# EAGLE design SB (EAGLE 7.7.0)
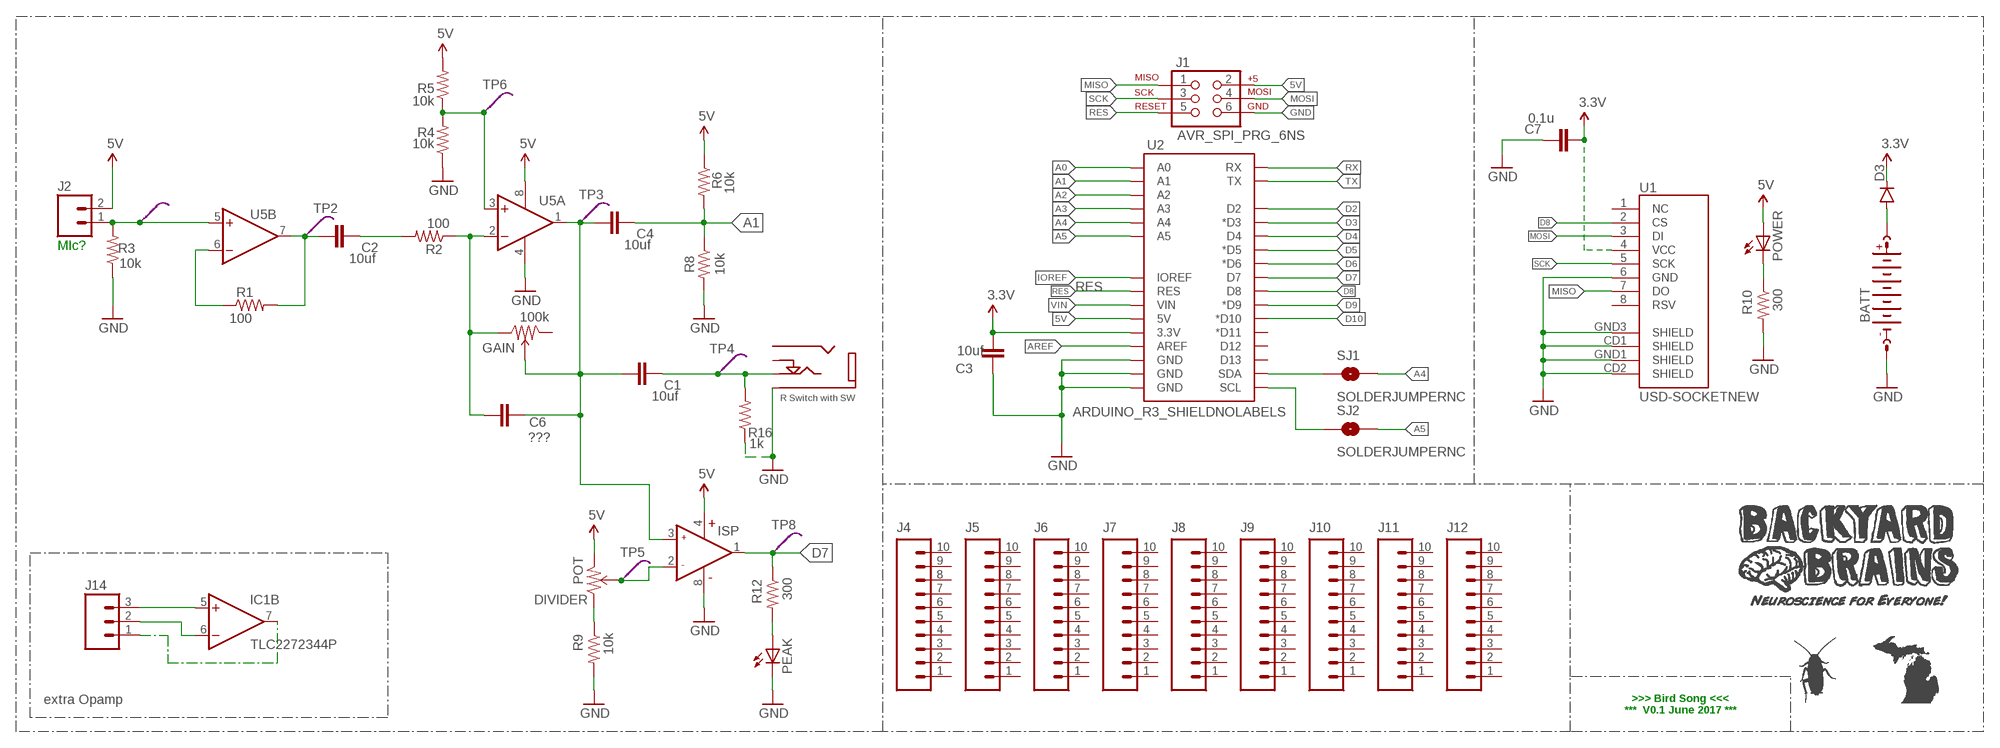
[diagram p0: schematic, sheet 1]

## Parts
BATT  BATTERY-16MMSMD  [16M_BATT_SMD]
C1  10uf  M2-CAP  [M2-CAP]
C2  10uf  M2-CAP  [M2-CAP]
C3  10uf  M2-CAP  [M2-CAP]
C4  10uf  M2-CAP  [M2-CAP]
C6  ???  M2-CAP  [M2-CAP]
C7  0.1u  M2-CAP  [M2-CAP]
D3  DIODE1N4148  [DIODE-1N4148]
DIVIDER  POT  [BURNS-SCREW-POT]
GAIN  100k  POT  [BURNS-SCREW-POT]
IC1  TLC2272344P  [DIL08]
J1  AVR_SPI_PRG_6NS  [2X3-NS]
J2  M02PTH  [1X02]
J3  AUDIOJACK  [3.5MM-SMALL-JACK-NEW]
J4  M10SILK_FEMALE_PTH  [1X10]
J5  M10SILK_FEMALE_PTH  [1X10]
J6  M10SILK_FEMALE_PTH  [1X10]
J7  M10SILK_FEMALE_PTH  [1X10]
J8  M10SILK_FEMALE_PTH  [1X10]
J9  M10SILK_FEMALE_PTH  [1X10]
J10  M10SILK_FEMALE_PTH  [1X10]
J11  M10SILK_FEMALE_PTH  [1X10]
J12  M10SILK_FEMALE_PTH  [1X10]
J14  M03PTH  [1X03]
PEAK  LED5MM  [LED5MM]
POWER  LED5MM  [LED5MM]
R1  100  M2-RES  [M2-RES]
R2  100  M2-RES  [M2-RES]
R3  10k  M2-RES  [M2-RES]
R4  10k  M2-RES  [M2-RES]
R5  10k  M2-RES  [M2-RES]
R6  10k  M2-RES  [M2-RES]
R8  10k  M2-RES  [M2-RES]
R9  10k  M2-RES  [M2-RES]
R10  300  M2-RES  [M2-RES]
R12  300  M2-RES  [M2-RES]
R16  1k  M2-RES  [M2-RES]
SJ1  SOLDERJUMPERNC  [SJ_2S]
SJ2  SOLDERJUMPERNC  [SJ_2S]
TP1  TEST  [PROBE_TP]
TP2  TEST  [PROBE_TP]
TP3  TEST  [PROBE_TP]
TP4  TEST  [PROBE_TP]
TP5  TEST  [PROBE_TP]
TP6  TEST  [PROBE_TP]
TP8  TEST  [PROBE_TP]
U1  USD-SOCKETNEW  [MICRO-SD-SOCKET-PP]
U2  ARDUINO_R3_SHIELDNOLABELS  [UNO_R3_SHIELD_NOLABELS]
U5  TLC2272344P  [DIL08]

## Nets
3.3V: C3.1 C7.1 D3.C U1.4(VCC) U2.3.3V
5V: DIVIDER.1 IC1.4(A:V-) J1.2 J2.2 POWER.A R5.2 R6.1 U2.5V U5.8(A:V+)
A0: U2.A0
A1: C4.2 R6.2 R8.1 U2.A1
A2: U2.A2
A3: U2.A3
A4: SJ1.2 U2.A4
A5: SJ2.2 U2.A5
AMP2: C2.1 R1.2 TP2.P$1(TP) U5.7(B:OUT)
AREF: U2.AREF
D2: U2.D2
D3: U2.D3(*D3)
D4: U2.D4
D5: U2.D5(*D5)
D6: U2.D6(*D6)
D7: IC1.1(A:OUT) R12.1 TP8.P$1(TP) U2.D7
D8: U1.2(CS) U2.D8
D9: U2.D9(*D9)
D10: U2.D10(*D10)
FILTER: C1.1 C4.1 C6.2 GAIN.2 IC1.3(A:IN+) TP3.P$1(TP) U5.1(A:OUT)
GND: BATT.NEG(-) C3.2 C7.2 IC1.8(A:V+) J1.6 J3.SHIELD PEAK.K(C) R3.1 R4.1 R8.2 R9.2 R10.2 R16.1 U1.6(GND) U1.CD1(SHIELD) U1.CD2(SHIELD) U1.GND1(SHIELD) U1.GND3(SHIELD) U2.GND@0(GND) U2.GND@1(GND) U2.GND@2(GND) U5.4(A:V-)
IOREF: U2.IOREF
MISO: J1.1 U1.7(DO)
MOSI: J1.4 U1.3(DI)
N$1: J2.1 R3.2 TP1.P$1(TP) U5.5(B:+IN)
N$2: BATT.POS1(+) BATT.POS2(+) D3.A
N$3: R1.1 U5.6(B:-IN)
N$4: C2.2 R2.2
N$5: R4.2 R5.1 TP6.P$1(TP) U5.3(A:+IN)
N$6: POWER.K(C) R10.1
N$7: DIVIDER.3 R9.1
N$8: IC1.5(B:+IN) J14.3
N$9: IC1.6(B:-IN) J14.2
N$10: IC1.7(B:OUT) J14.1
N$11: DIVIDER.2 IC1.2(A:IN-) TP5.P$1(TP)
N$14: PEAK.A R12.2
N$17: C1.2 J3.R R16.2 TP4.P$1(TP)
N$21: C6.1 GAIN.3 R2.1 U5.2(A:-IN)
RES: J1.5 U2.RES
RX: U2.RX
SCK: J1.3 U1.5(SCK)
SCL: SJ2.1 U2.SCL
SDA: SJ1.1 U2.SDA
TX: U2.TX
VIN: U2.VIN
Unconnected: GAIN.1 J3.L J3.SW(SWITCH) J4.1 J4.2 J4.3 J4.4 J4.5 J4.6 J4.7 J4.8 J4.9 J4.10 J5.1 J5.2 J5.3 J5.4 J5.5 J5.6 J5.7 J5.8 J5.9 J5.10 J6.1 J6.2 J6.3 J6.4 J6.5 J6.6 J6.7 J6.8 J6.9 J6.10 J7.1 J7.2 J7.3 J7.4 J7.5 J7.6 J7.7 J7.8 J7.9 J7.10 J8.1 J8.2 J8.3 J8.4 J8.5 J8.6 J8.7 J8.8 J8.9 J8.10 J9.1 J9.2 J9.3 J9.4 J9.5 J9.6 J9.7 J9.8 J9.9 J9.10 J10.1 J10.2 J10.3 J10.4 J10.5 J10.6 J10.7 J10.8 J10.9 J10.10 J11.1 J11.2 J11.3 J11.4 J11.5 J11.6 J11.7 J11.8 J11.9 J11.10 J12.1 J12.2 J12.3 J12.4 J12.5 J12.6 J12.7 J12.8 J12.9 J12.10 U1.1(NC) U1.8(RSV) U2.D11(*D11) U2.D12 U2.D13

## Notes on the sheet
- MIc?
- extra Opamp
- >>> Bird Song <<<
  ***  V0.1 June 2017 ***

## Library data of the parts
BATT = byb:BATTERY-16MM
C1-C4 C6 C7 = 1MaxBYB:M2-CAP; DIGIKEY: BC1150CT-ND; MANUFACTURER: Vishay/BC Components; PARTNO: K474Z20Y5VE5TL2
D3 = SparkFun-DiscreteSemi:DIODE: Diode These are standard reverse protection diodes and small signal diodes. SMA package can handle up to about 1A. SOD-323 can handle about 200mA. What the SOD-323 package when ordering, there are some mfgs out there that are 5-pin packages.
DIVIDER GAIN = 1MaxBYB:POT
IC1 = 1MaxBYB:TLC2272: Dual Operational Amplifier Low Power, Single-Supply, Rail-To-Rail Operational Amplifier Source: http://focus.ti.com/lit/ds/symlink/opa2345.pdf http://focus.ti.com .. opa241.pdf http://focus.ti.com/lit/ds/symlink/opa2134.pdf
J1 = SparkFun-Connectors:AVR_SPI_PRG_6: AVR ISP 6 Pin This is the reduced ISP connector for AVR programming. Common on Arduino. This footprint will take up less PCB space and can be used with a 10-pin to 6-pin adapter such as SKU: BOB-08508
J2 = SparkFun-Connectors:M02: Standard 2-pin 0.1" header. Use with - straight break away headers ( PRT-00116) - right angle break away headers (PRT-00553) - swiss pins (PRT-00743) - machine pins (PRT-00117) - female headers (PRT-00115) Molex polarized connector foot print use with: PRT-08233 with associated crimp pins and housings. 2.54_SCREWTERM for use with PRT-10571. 3.5mm Screw Terminal footprints for PRT-08084 5mm Screw Terminal footprints for use with PRT-08432
J3 = MaxBYB:AUDIOJACK: 1/8" Audio Jack
J4-J12 = SparkFun-Connectors:M10: Header 10 Standard 10-pin 0.1" header. Use with straight break away headers (SKU : PRT-00116), right angle break away headers (PRT-00553), swiss pins (PRT-00743), machine pins (PRT-00117), and female headers (PRT-00115).; PROD_ID: CONN-11563
J14 = SparkFun-Connectors:M03: Header 3 Standard 3-pin 0.1" header. Use with straight break away headers (SKU : PRT-00116), right angle break away headers (PRT-00553), swiss pins (PRT-00743), machine pins (PRT-00117), and female headers (PRT-00115). Molex polarized connector foot print use with SKU : PRT-08232 with associated crimp pins and housings.
PEAK POWER = SparkFun-LED:LED: LEDs Standard schematic elements and footprints for 5mm, 3mm, 1206, and 0603 sized LEDs. 5mm - Spark Fun Electronics SKU : COM-00529 (and others)
R1 R2 R4 R5 R9 R10 R12 = 1MaxBYB:M2-RES; DIGIKEY: CF14JT390RCT-ND; MANUFACTURER: Stackpole Electronics; PARTNO: CF14JT390R
R3 R6 R8 R16 = 1MaxBYB:M2-RES; DIGIKEY: P1.0KBACT-ND; MANUFACTURER: Panasonic - ECG; PARTNO: ERD-S2TJ102V
SJ1 SJ2 = SparkFun-Passives:SOLDERJUMPER: Solder Jumper Standard SMD solder jumper. Used to automate production. Two varients : Normally Open and Normally Closed are the same, but have different paste layers. NC will have a large amount of paste and should jumper during reflow.
TP1-TP6 TP8 = 1MaxBYB:TEST
U1 = SparkFun:USD-SOCKET: microSD Socket Push-push type uSD socket. Schematic element and footprint production proven. Spark Fun Electronics SKU : PRT-00127. tDoc lines correctly indicate media card edge positions when inserting (unlocked, locked, depressed).
U2 = SparkFun-Boards:ARDUINO_R3_SHIELD: Shield form compatible with the Arduino Uno R3.
U5 = byb:TLC2272: Dual Operational Amplifier Low Power, Single-Supply, Rail-To-Rail Operational Amplifier Source: http://focus.ti.com/lit/ds/symlink/opa2345.pdf http://focus.ti.com .. opa241.pdf http://focus.ti.com/lit/ds/symlink/opa2134.pdf; DIGIKEY: 296-1812-5-ND; MANUFACTURER: TEXAS INSTRUMENTS; PARTNO: TLC2272CP

## Board
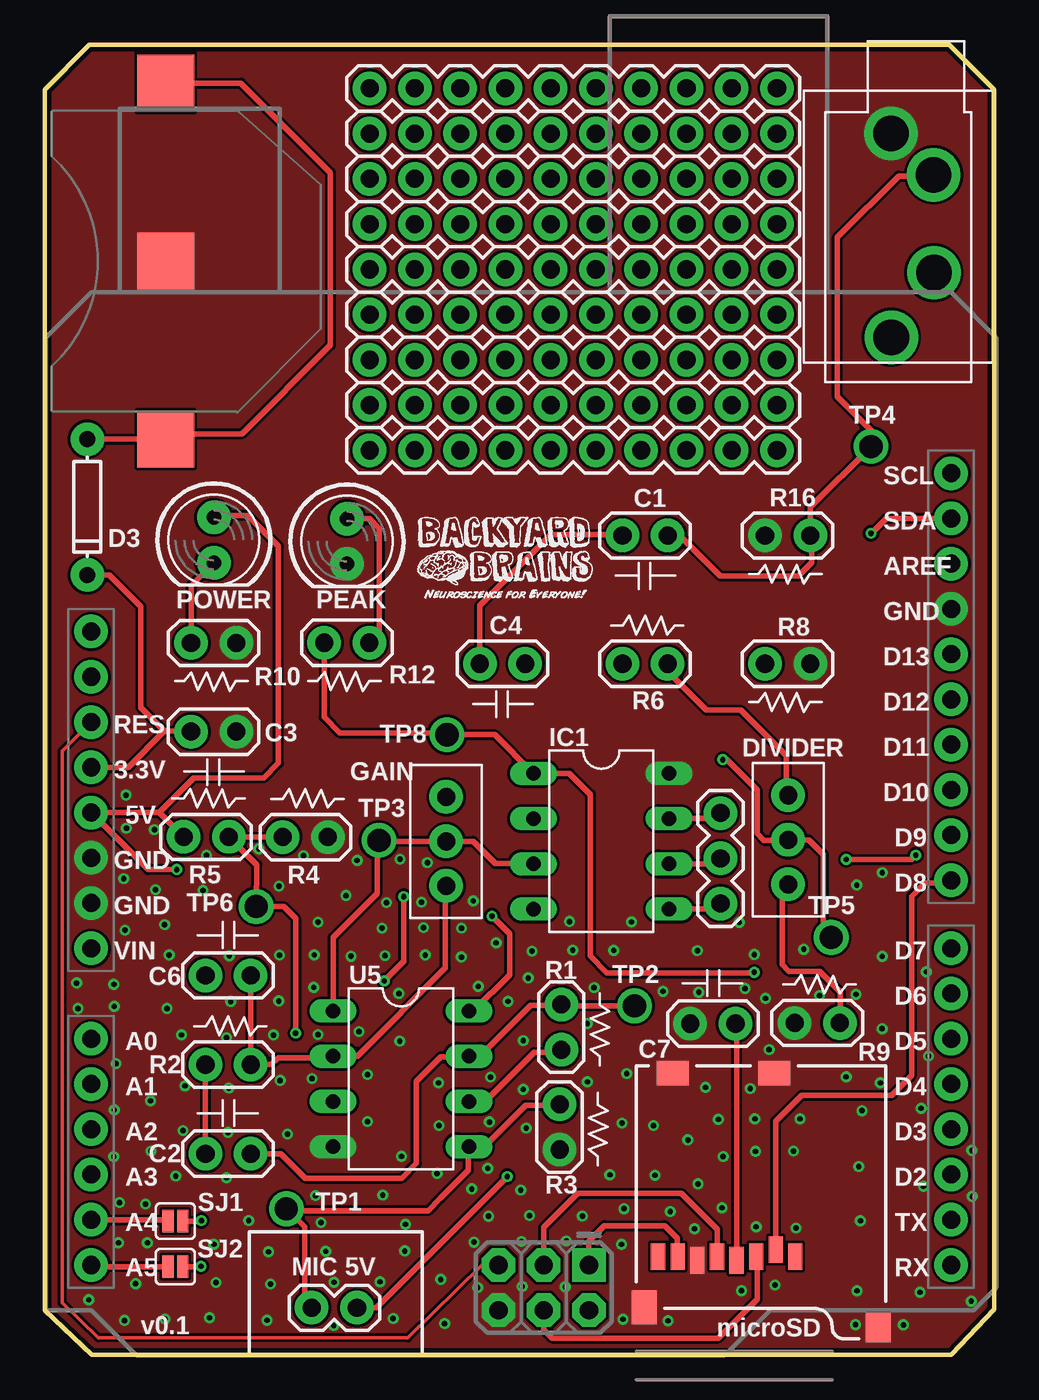
[diagram p1: board, top side]
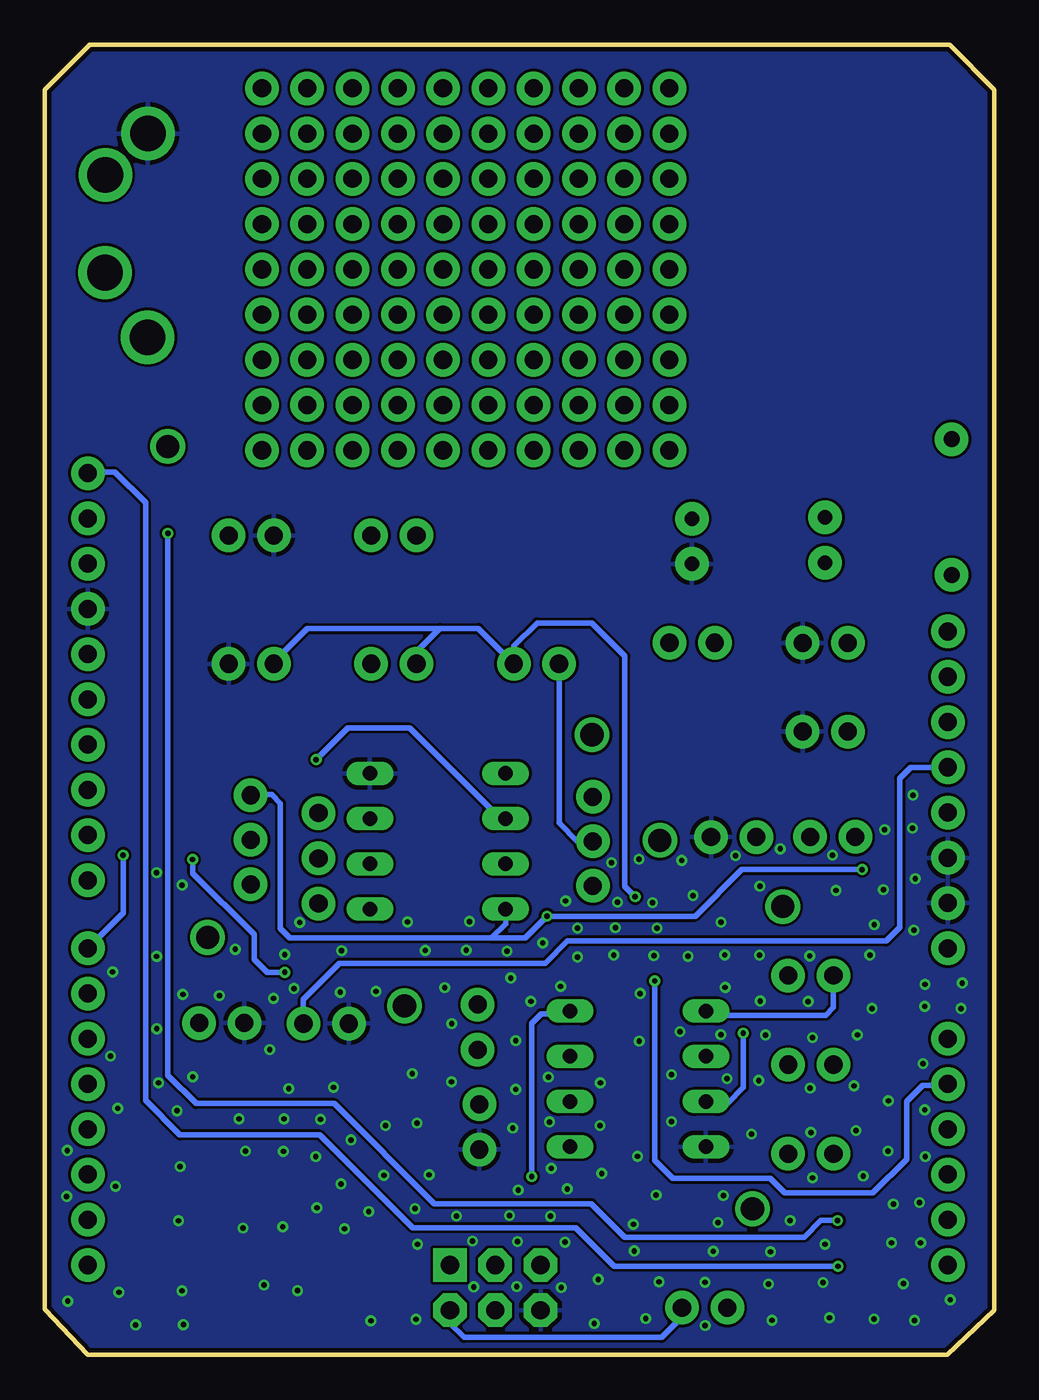
[diagram p2: board, bottom side, seen from below]

Size 53.3 x 73.56 mm. Coordinates in mm from the lower left corner, seen from the top.
Outline: 53.3,2.58 53.3,71.02 50.77,73.56
Outline: 2.5,73.55 0,71.02 0,2.51 2.65,0 50.87,0 53.3,2.56
Outline: 2.5,73.55 2.51,73.56
Outline: 2.5,73.55 50.8,73.55
Copper layers (1*16): Top 0.035mm / dielectric 1.5mm / Bottom 0.035mm
Design rules "SeeedStudio_2layer_DRU_no_angle_20140221-1 *": minimum track width 0.156mm, minimum drill 0.3mm, track to track 6mil, track to pad 6mil, pad to pad 6mil, via to via 6mil, smd to smd 0mil, copper to edge 10mil, drill to drill 10mil, minimum pad ring 10mil, minimum via ring 6mil, stop-mask expansion 2mil, vias tented up to drill 100mil, thermal gap 10mil

### Footprints (pad centres in the part's own frame; a part is rotated, then mirrored left to right if it is on the bottom)
16M_BATT_SMD = smd 3.2 x 3.2: NEG 0,0; POS1 -10,0; POS2 10,0
M2-CAP = drill 1.016 pad 1.88: 1 -1.27,0; 2 1.27,0
DIODE-1N4148 = drill 0.9 pad 1.88: A -3.81,0; C 3.81,0
BURNS-SCREW-POT = drill 1.016 pad 1.88: 1 -2.5,0; 2 0,0; 3 2.5,0
DIL08 = drill 0.813 pad 1.27 long: 1 -3.81,-3.81; 2 -1.27,-3.81; 3 1.27,-3.81; 4 3.81,-3.81; 5 3.81,3.81; 6 1.27,3.81; 7 -1.27,3.81; 8 -3.81,3.81
2X3-NS = drill 1.016 pad 1.88 square: 1 -2.54,-1.27 | drill 1.016 pad 1.88 octagon: 2 -2.54,1.27; 3 0,-1.27; 4 0,1.27; 5 2.54,-1.27; 6 2.54,1.27
1X02 = drill 1.016 pad 1.88: 1 0,0; 2 2.54,0
3.5MM-SMALL-JACK-NEW = drill 2 pad 2.184: L 3.645,1.202; R -1.849,1.192; SHIELD -4.159,-1.205; SW 7.271,-1.185
1X10 = drill 1.016 pad 1.88: 1 0,0; 2 2.54,0; 3 5.08,0; 4 7.62,0; 5 10.16,0; 6 12.7,0; 7 15.24,0; 8 17.78,0; 9 20.32,0; 10 22.86,0
1X03 = drill 1.016 pad 1.88: 1 0,0; 2 2.54,0; 3 5.08,0
LED5MM = drill 0.813 pad 1.88: A -1.27,0; K 1.27,0
M2-RES = drill 1.016 pad 1.88: 1 -1.27,0; 2 1.27,0
SJ_2S = smd 0.635 x 1.27: 1 -0.412,0; 2 0.412,0
PROBE_TP = drill 1.3 pad 1.7: P$1 0,0
MICRO-SD-SOCKET-PP = smd 0.8 x 1.5: 1 -8.94,10.7; 2 -7.84,10.3; 3 -6.74,10.7; 4 -5.64,10.9; 5 -4.54,10.7; 6 -3.44,10.9; 7 -2.34,10.7; 8 -1.24,10.7 | smd 1.8 x 1.4: CD1 -2.05,0.4; CD2 -7.75,0.4 | smd 1.4 x 1.9: GND1 -13.6,14.55; GND3 -0.45,13.55
UNO_R3_SHIELD_NOLABELS = drill 1.016 pad 1.88: 3.3V 50.8,26.67; 5V 50.8,29.21; A0 50.8,41.91; A1 50.8,44.45; A2 50.8,46.99; A3 50.8,49.53; A4 50.8,52.07; A5 50.8,54.61; AREF 2.54,15.24; D2 2.54,49.53; D3 2.54,46.99; D4 2.54,44.45; D5 2.54,41.91; D6 2.54,39.37; D7 2.54,36.83; D8 2.54,33.02; D9 2.54,30.48; D10 2.54,27.94; D11 2.54,25.4; D12 2.54,22.86; D13 2.54,20.32; GND@0 50.8,31.75; GND@1 50.8,34.29; GND@2 2.54,17.78; IOREF 50.8,21.59; NC 50.8,19.05; RES 50.8,24.13; RX 2.54,54.61; SCL 2.54,10.16; SDA 2.54,12.7; TX 2.54,52.07; VIN 50.8,36.83

### Placement (x,y rotation side)
BATT  6.8,61.4 90 top
C1  33.7,46 0 top
C2  10.3,11.3 180 top
C3  9.49,34.99 0 top
C4  25.7,38.8 0 top
C6  10.3,21.3 180 top
C7  37.5,18.6 180 top
D3  2.4,47.6 270 top
DIVIDER  41.73,28.92 270 top
GAIN  22.53,28.83 270 top
IC1  31.24,28.84 270 top
J1  28.01,3.78 180 top
J2  14.99,2.65 0 top
J3  48.7,64.4 270 top
J4  41.1,68.56 180 top
J5  41.1,71.1 180 top
J6  41.1,58.4 180 top
J7  41.1,60.94 180 top
J8  41.1,63.48 180 top
J9  41.1,66.02 180 top
J10  41.1,55.86 180 top
J11  41.1,53.32 180 top
J12  41.1,50.78 180 top
J14  37.93,30.42 270 top
PEAK  16.97,45.68 270 top
POWER  9.5,45.75 270 top
R1  29,18.4 90 top
R2  10.3,16.3 180 top
R3  28.9,12.8 90 top
R4  14.63,29.07 180 top
R5  9.07,29.08 180 top
R6  33.7,38.8 180 top
R8  41.7,38.8 0 top
R9  43.36,18.64 180 top
R10  9.49,39.97 0 top
R12  16.96,39.98 0 top
R16  41.7,46 0 top
SJ1  7.34,7.51 180 top
SJ2  7.34,4.96 180 top
TP1  13.57,8.21 0 top
TP2  33.1,19.6 0 top
TP3  18.77,28.89 0 top
TP4  46.38,51 0 top
TP5  44.15,23.44 180 top
TP6  11.88,25.17 0 top
TP8  22.58,34.82 0 top
U1  33.19,16.22 180 top
U2  53.41,59.66 180 top
U5  20,15.5 270 top
U$1  [LOGO-NEW-SMALL]  20.81,41.73 0 top

### Tracks (layer width: path | path; a pad name or v marks a point on that pad's centre or on a via)
3.3V
  Top 0.3: U1.4 38.83,18.54 C7.1 | D3.C 3.62,43.79 5.41,42 5.41,36.34 6.73,35.02 | 6.73,35.02 8.19,35.02 C3.1 | U2.3.3V 4.7,32.99 6.73,35.02
  Bottom 0.3: C7.1 38.77,19.96 36.75,21.98 25.21,21.98 23.96,23.23 6.08,23.23 5.32,23.99 5.32,32.37 4.7,32.99 U2.3.3V
5V  (via drill 0.3)
  Top 0.3: 6.43,30.45 U2.5V 5.81,27.25 v7.42,27.25 | 6.43,30.45 R5.2 | POWER.A 9.61,47.13 11.39,47.13 13.12,45.4 13.12,33.22 12.29,32.39 8.37,32.39 6.43,30.45 | R6.1 34.97,38.37 37.14,36.2 39.06,36.2 41.61,33.65 41.61,31.54 DIVIDER.1 | U5.8 24.07,19.31 26.1,21.34 26.1,23.64 v25.11,24.63 | J2.2 18.6,2.65 v25.96,10.01
  Bottom 0.3: J2.2 17.54,2.12 18.68,0.98 29.75,0.98 30.56,1.79 J1.2 | 28.23,23.4 39.53,23.4 40.06,23.93 40.06,30.97 40.56,31.47 41.68,31.47 DIVIDER.1 | IC1.4 27.43,24.2 28.23,23.4 | 28.23,23.4 26.34,23.4 v25.11,24.63 16.8,24.63 14.18,27.25 v7.42,27.25 | v25.96,10.01 25.96,18.62 25.43,19.15 23.97,19.15 U5.8
A1  (via drill 0.3)
  Top 0.3: v19.06,21 20.15,22.09 v20.15,25.72 v20.16,25.73
  Bottom 0.3: R8.1 40.43,38.91 38.56,40.78 31.11,40.78 | 31.11,40.78 28.95,40.78 C4.2 26.97,39.79 25.66,41.1 22.6,41.1 20.73,39.23 20.73,26.29 v20.16,25.72 v20.16,25.73 | R6.2 32.43,39.46 31.11,40.78 | v19.06,21 19.06,10.93 18.05,9.92 12.59,9.92 11.76,9.09 6.83,9.09 4.93,10.99 4.93,14.23 4.03,15.13 2.69,15.13 U2.A1
A4
  Top 0.3: U2.A4 6.85,7.59 SJ1.2
A5
  Top 0.3: SJ2.2 2.7,4.96 U2.A5
AMP2
  Top 0.3: TP2.P$1 29.07,19.6 R1.2 28.96,19.71 28.48,19.71 28.4,19.63 27.28,19.63 24.42,16.77 U5.7 23.78,16.74 22.24,16.74 20.87,15.37 20.87,10.75 20.04,9.92 14.63,9.92 13.25,11.3 C2.1
D7  (via drill 0.3)
  Top 0.3: R12.1 15.69,35.8 16.57,34.92 22.48,34.92 TP8.P$1 25.26,34.82 IC1.1 29.45,32.65 30.63,31.47 30.63,22.39 31.56,21.46 39.8,21.46 v39.82,21.48 | v44.99,27.82 48.65,27.82 v48.89,28.06
  Bottom 0.3: v48.89,28.06 48.89,24.81 U2.D7 | v39.82,21.48 40.81,21.48 41.54,22.21 41.54,23.6 44.97,27.03 44.97,27.8 v44.99,27.82
D8
  Top 0.3: U1.2 41.03,13.12 42.49,14.58 47.53,14.58 48.65,15.7 48.65,25.75 49.4,26.5 50.73,26.5 U2.D8
FILTER
  Top 0.3: IC1.3 27.41,27.59 25.29,27.59 24.05,28.83 GAIN.2 18.83,28.83 TP3.P$1 18.66,28.78 18.66,25.91 16.19,23.44 U5.1 | C4.1 24.43,42.08 28.41,46.06 32.37,46.06 C1.1
  Bottom 0.3: C6.2 9.03,19.5 9.46,19.07 15.95,19.07 U5.1 | C4.1 24.43,29.85 23.41,28.83 GAIN.2
GND  (via drill 0.3)
  other vias: 2.48,3.1 4.48,1.94 6.76,2.02 9.25,2.09 12.48,1.95 12.68,3.98 9.62,4.06 5.11,4 4.14,6.3 5.77,6.3 4.2,8.55 5.67,8.47 9.5,6.21 12.57,5.79 15.78,5.82 20.21,5.84 18.82,4.11 16.24,4.08 15.51,7.43 20.26,7.33 11.46,7.55 15.21,8.95 18.98,8.97 22.03,10.19 20.03,11.15 19.93,17.62 22.11,15.27 22.13,12.88 18.12,15.74 18.12,13.1 15.01,15.51 13.22,15.41 13.63,12.4 10.3,12.49 10.34,14.98 7.88,15.11 7.77,12.6 10.21,9.94 7.36,10.04 3.88,11.14 3.91,13.76 4.01,16.36 5.97,11.44 5.95,14.26 24.1,6.33 26.76,6.36 29.28,6.39 26.8,3.84 29.22,3.82 24.31,3.79 22.45,1.76 19.56,2.04 22.23,4.24 16.23,1.65 32.37,6.21 32.46,2 34.99,1.92 39.11,3.61 36.47,7.08 35.11,8.05 32.51,8.21 30.18,7.8 27.21,7.82 24.91,7.79 38.02,8.26 39.93,7.19 42.17,7.12 40.99,3.93 45.51,1.7 48.19,1.69 52,3.02 42.03,11.45 39.9,11.43 38.08,11.14 36.67,9.6 34.26,10.08 36.1,12.07 37.81,13.23 39.86,13.25 42.39,13.25 45.87,13.71 49.19,13.84 49.32,9.47 49.13,3.52 45.69,10.57 45.78,7.53 45.59,3.6 52.06,8.9 52.03,11.48 46.9,15.27 44.98,15.61 39.6,14.95 37.09,15.02 31.72,10.11 34.17,12.87 26.72,9.26 23.97,9.32 24.87,10.48 27.03,12.73 24.96,13.08 26.86,14.91 26.86,17.65 26.01,19.85 25.03,15.6 30.46,15.33 30.45,18.6 30.84,20.62 27.14,21.16 36.71,20.36 34.7,20.41 32.67,15.79 32.4,13.02 40.45,20.02 43.49,20.17 45.54,20.24 45.58,26.38 42.6,22.77 47,18.31 47.01,27.07 47.01,22.37 49.48,21.5 49.6,16.77 40.66,17.14 17.64,18.15 17.19,22.38 15.13,22.46 21.36,22.45 19.11,22.42 23.39,22.34 24.34,20.69 19.88,20.29 15.11,20.63 13.18,22.44 13.14,19.87 10.45,19.84 10.36,22.4 12.85,17.96 15.35,17.98 10.21,17.81 7.69,17.97 6.99,22.45 4.52,23.84 6.74,24.15 1.8,20.88 3.89,20.8 1.88,19.45 3.91,19.57 6.87,19.45 4.59,29.57 4.57,31.43 4.44,26.73 6.16,29.49 6.23,26.12 9.09,28.06 8.89,26.08 13.16,26.32 12.02,28.41 14.53,28.02 16.91,25.79 15.34,24.3 17.54,27.76 19.94,27.83 19.19,25.39 21.15,25.42 21.48,27.63 18.93,23.96 21.27,23.98 23.4,23.96 25.34,23.13 24.06,25.49 27.35,22.67 29.64,22.72 31.94,22.71 36.63,22.69 39.82,22.48 39.3,20.57 38.98,24.28 32.93,24.31 29.46,24.33
  pour Bottom: 50.77,73.56 53.31,71.02 53.41,3.78 53.54,3.11 53.31,2.51 50.77,-0.03 2.75,-0.13 0.21,2.41 0.07,2.51 -0.03,71.02 2.51,73.56
  pour Top (no thermals): 50.77,73.56 53.31,71.02 53.41,3.78 53.94,3.31 54.11,2.41 51.57,-0.13 2.65,-0.13 0.11,2.41 0.07,2.51 -0.03,71.02 2.51,73.56
MISO
  Top 0.3: J1.1 30.55,6.38 31.42,7.25 34.8,7.25 35.5,6.55 35.5,5.35 U1.7
MOSI
  Top 0.3: J1.4 28.01,1.42 28.49,0.94 37.8,0.94 39.98,3.12 39.98,5.47 U1.3
N$1
  Top 0.3: R3.2 28.85,14.02 27,14.02 24.67,11.69 U5.5 23.78,11.66 23.78,10.37 22.21,8.8 22.21,8.79 21.52,8.1 13.68,8.1 TP1.P$1 14.6,7.18 14.6,2.8 14.75,2.65 J2.1
N$2
  Top 0.3: BATT.POS2 11.01,71.4 16.04,66.37 16.04,56.68 11.06,51.7 7.1,51.7 BATT.POS1 D3.A
N$3
  Top 0.3: U5.6 24.72,14.23 27.47,16.98 28.85,16.98 R1.1
N$4
  Top 0.3: R2.2 C2.2
N$5  (via drill 0.3)
  Top 0.3: R4.2 R5.1 11.91,27.51 TP6.P$1 13.42,25.17 14.09,24.5 v14.09,18.06
  Bottom 0.3: v14.09,18.06 14.09,15.01 14.97,14.13 16.09,14.13 U5.3
N$6
  Top 0.3: R10.1 8.22,43.2 POWER.K
N$7
  Top 0.3: R9.1 44.66,18.67 44.66,20.38 43.5,21.54 41.77,21.54 41.4,21.91 41.4,26.09 DIVIDER.3
N$8
  Top 0.3: IC1.5 37.77,25.03 J14.3
N$9
  Top 0.3: IC1.6 37.77,27.57 J14.2
N$10
  Top 0.3: IC1.7 37.77,30.11 J14.1
N$11  (via drill 0.3)
  Top 0.3: TP5.P$1 43.7,23.89 43.7,28.09 42.87,28.92 DIVIDER.2 41.7,28.89 40.37,28.89 39.99,29.27 39.99,31.71 38.28,33.42 v38.06,33.42
  Bottom 0.3: IC1.2 27.74,30.11 32.82,35.19 36.28,35.19 37.88,33.59 37.89,33.59 v38.06,33.42
N$14
  Top 0.3: PEAK.A 18.24,46.95 18.79,46.4 18.79,40.54 R12.2
N$17
  Top 0.3: C1.2 35.64,46 37.91,43.73 42.28,43.73 43.04,44.49 43.04,45.93 R16.2 42.97,47.59 TP4.P$1 46.38,51.9 44.49,53.79 44.49,62.75 47.92,66.18 49.82,66.18 J3.R
N$21
  Top 0.3: C6.1 R2.1 12.72,16.3 13.1,16.68 16.1,16.68 U5.2 17.54,16.77 22.49,21.72 22.49,26.29 GAIN.3
RES
  Top 0.2: J1.5 24.56,5.05 20.39,0.96 3.02,0.96 0.98,2.92 0.98,33.9 U2.RES
SCK
  Top 0.3: J1.3 28.01,7.16 29.91,9.06 35.74,9.06 37.75,7.05 37.75,5.34 U1.5
SCL  (via drill 0.3)
  Top 0.3: SJ2.1 8.76,4.96 v8.78,4.98
  Bottom 0.3: v8.78,4.98 21.33,4.98 23.49,7.14 32.64,7.14 37.85,12.35 45.7,12.35 47.63,14.28 47.63,47.84 49.35,49.56 50.81,49.56 U2.SCL
SDA  (via drill 0.3)
  Top 0.3: SJ1.1 8.77,7.51 v8.8,7.55 | U2.SDA 47.22,46.96 v46.38,46.12
  Bottom 0.3: v8.8,7.55 9.74,7.55 10.68,6.61 20.73,6.61 22.61,8.49 31.42,8.49 37.04,14.11 44.8,14.11 46.38,15.69 v46.38,46.12

### Text on the board
tPlace: SCL | SDA | AREF | GND | D13 | D12 | RES | D11 | 3.3V | D10 | 5V | D9 | GND | D8 | GND | VIN | D7 | D6 | A0 | D5 | A1 | D4 | A2 | D3 | A3 | D2 | A4 | TX | A5 | RX
tNames: MIC 5V | v0.1 | microSD